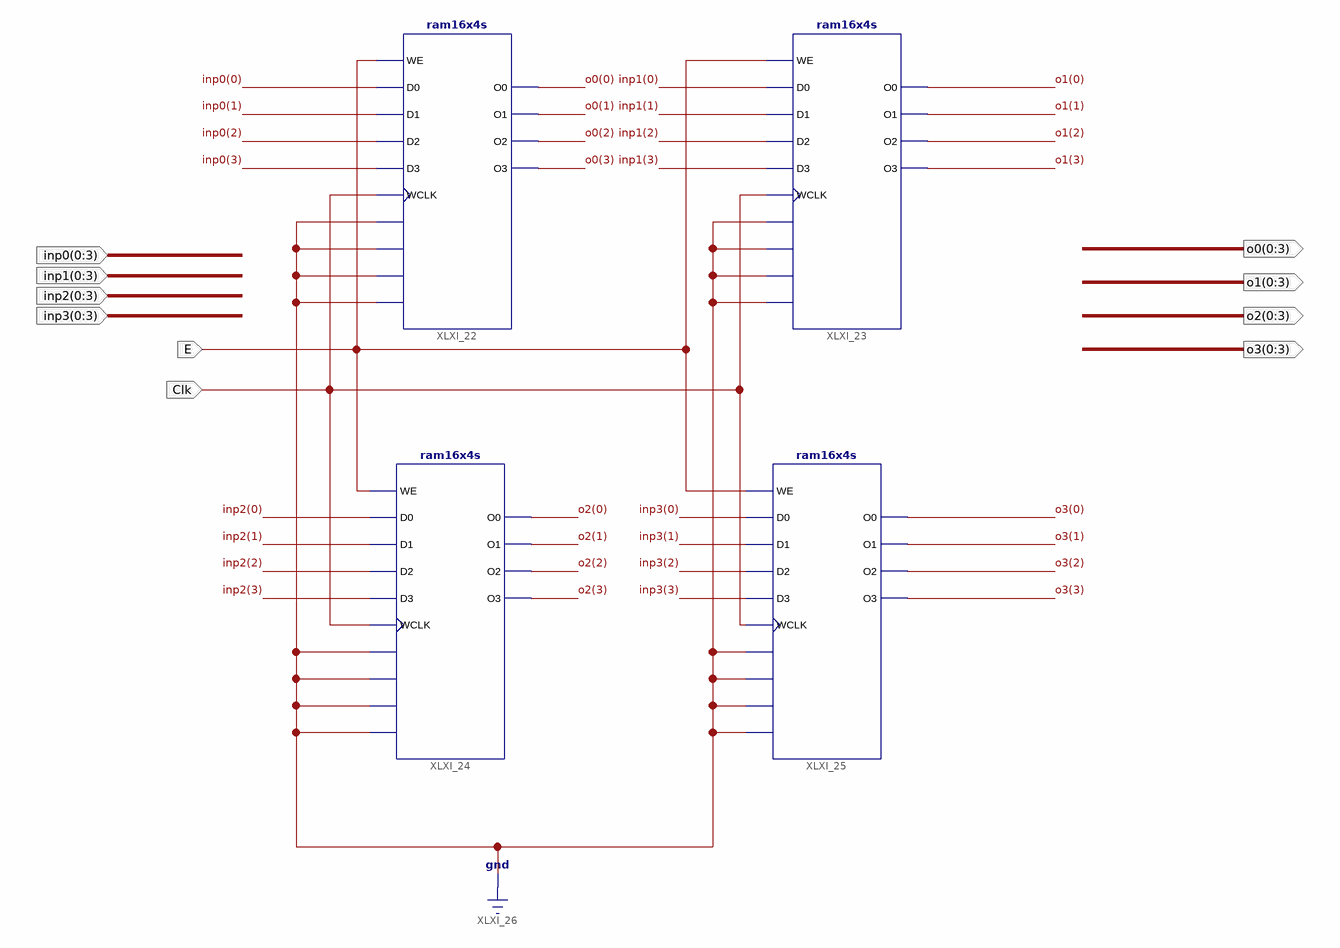
[diagram p0: schematic sheet 1]
// Xilinx ISE schematic MyRam2.sch (spartan6) as structural Verilog: 4 symbols, 10 ports
module MyRam2 (
  input  Clk,
  input  E,
  input  [0:3] inp0,
  input  [0:3] inp1,
  input  [0:3] inp2,
  input  [0:3] inp3,
  output [0:3] o0,
  output [0:3] o1,
  output [0:3] o3,
  output [0:3] o2
);

  ram16x4s XLXI_22 (
    .A0(1'b0), .A1(1'b0), .A2(1'b0), .A3(1'b0), .D0(inp0[0]), .D1(inp0[1]), .D2(inp0[2]), .D3(inp0[3]),
    .WCLK(Clk), .WE(E), .O0(o0[0]), .O1(o0[1]), .O2(o0[2]), .O3(o0[3]));
  ram16x4s XLXI_24 (
    .A0(1'b0), .A1(1'b0), .A2(1'b0), .A3(1'b0), .D0(inp2[0]), .D1(inp2[1]), .D2(inp2[2]), .D3(inp2[3]),
    .WCLK(Clk), .WE(E), .O0(o2[0]), .O1(o2[1]), .O2(o2[2]), .O3(o2[3]));
  ram16x4s XLXI_23 (
    .A0(1'b0), .A1(1'b0), .A2(1'b0), .A3(1'b0), .D0(inp1[0]), .D1(inp1[1]), .D2(inp1[2]), .D3(inp1[3]),
    .WCLK(Clk), .WE(E), .O0(o1[0]), .O1(o1[1]), .O2(o1[2]), .O3(o1[3]));
  ram16x4s XLXI_25 (
    .A0(1'b0), .A1(1'b0), .A2(1'b0), .A3(1'b0), .D0(inp3[0]), .D1(inp3[1]), .D2(inp3[2]), .D3(inp3[3]),
    .WCLK(Clk), .WE(E), .O0(o3[0]), .O1(o3[1]), .O2(o3[2]), .O3(o3[3]));
endmodule
